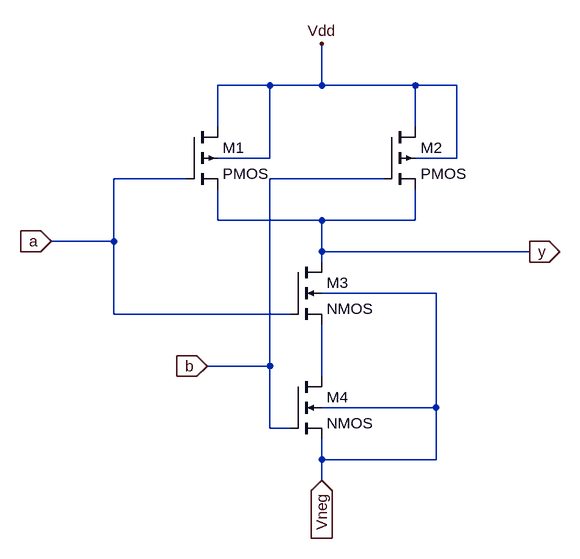
[diagram p0: schematic nandsymb.asc]
nandsymb.asc, the LTspice schematic file:
Version 4
SHEET 1 972 712
WIRE 512 0 432 0
WIRE 592 0 592 -64
WIRE 592 0 512 0
WIRE 736 0 592 0
WIRE 800 0 736 0
WIRE 432 64 432 0
WIRE 736 64 736 0
WIRE 512 112 512 0
WIRE 512 112 432 112
WIRE 800 112 800 0
WIRE 800 112 736 112
WIRE 384 144 272 144
WIRE 688 144 512 144
WIRE 432 208 432 160
WIRE 592 208 432 208
WIRE 736 208 736 160
WIRE 736 208 592 208
WIRE 272 240 272 144
WIRE 272 240 176 240
WIRE 592 256 592 208
WIRE 912 256 592 256
WIRE 592 272 592 256
WIRE 768 320 592 320
WIRE 272 352 272 240
WIRE 544 352 272 352
WIRE 512 432 512 144
WIRE 512 432 416 432
WIRE 592 448 592 368
WIRE 768 496 768 320
WIRE 768 496 592 496
WIRE 512 528 512 432
WIRE 544 528 512 528
WIRE 592 576 592 544
WIRE 768 576 768 496
WIRE 768 576 592 576
WIRE 592 608 592 576
FLAG 592 -64 Vdd
FLAG 912 256 y
IOPIN 912 256 Out
FLAG 176 240 a
IOPIN 176 240 In
FLAG 416 432 b
IOPIN 416 432 In
FLAG 592 608 Vneg
IOPIN 592 608 In
SYMBOL pmos4 384 64 R0
SYMATTR InstName M1
SYMBOL pmos4 688 64 R0
SYMATTR InstName M2
SYMBOL nmos4 544 272 R0
SYMATTR InstName M3
SYMBOL nmos4 544 448 R0
SYMATTR InstName M4

The netlist it stands for:
* nandsymb.asc
M1 Vdd a y Vdd PMOS
M2 Vdd b y Vdd PMOS
M3 y a N001 Vneg NMOS
M4 N001 b Vneg Vneg NMOS
.model NMOS NMOS
.model PMOS PMOS
.lib standard.mos
.backanno
.end